# Altium schematic sheet RP2_pico.SchDoc
size A3; SheetNumber: 1; SheetTotal: 4
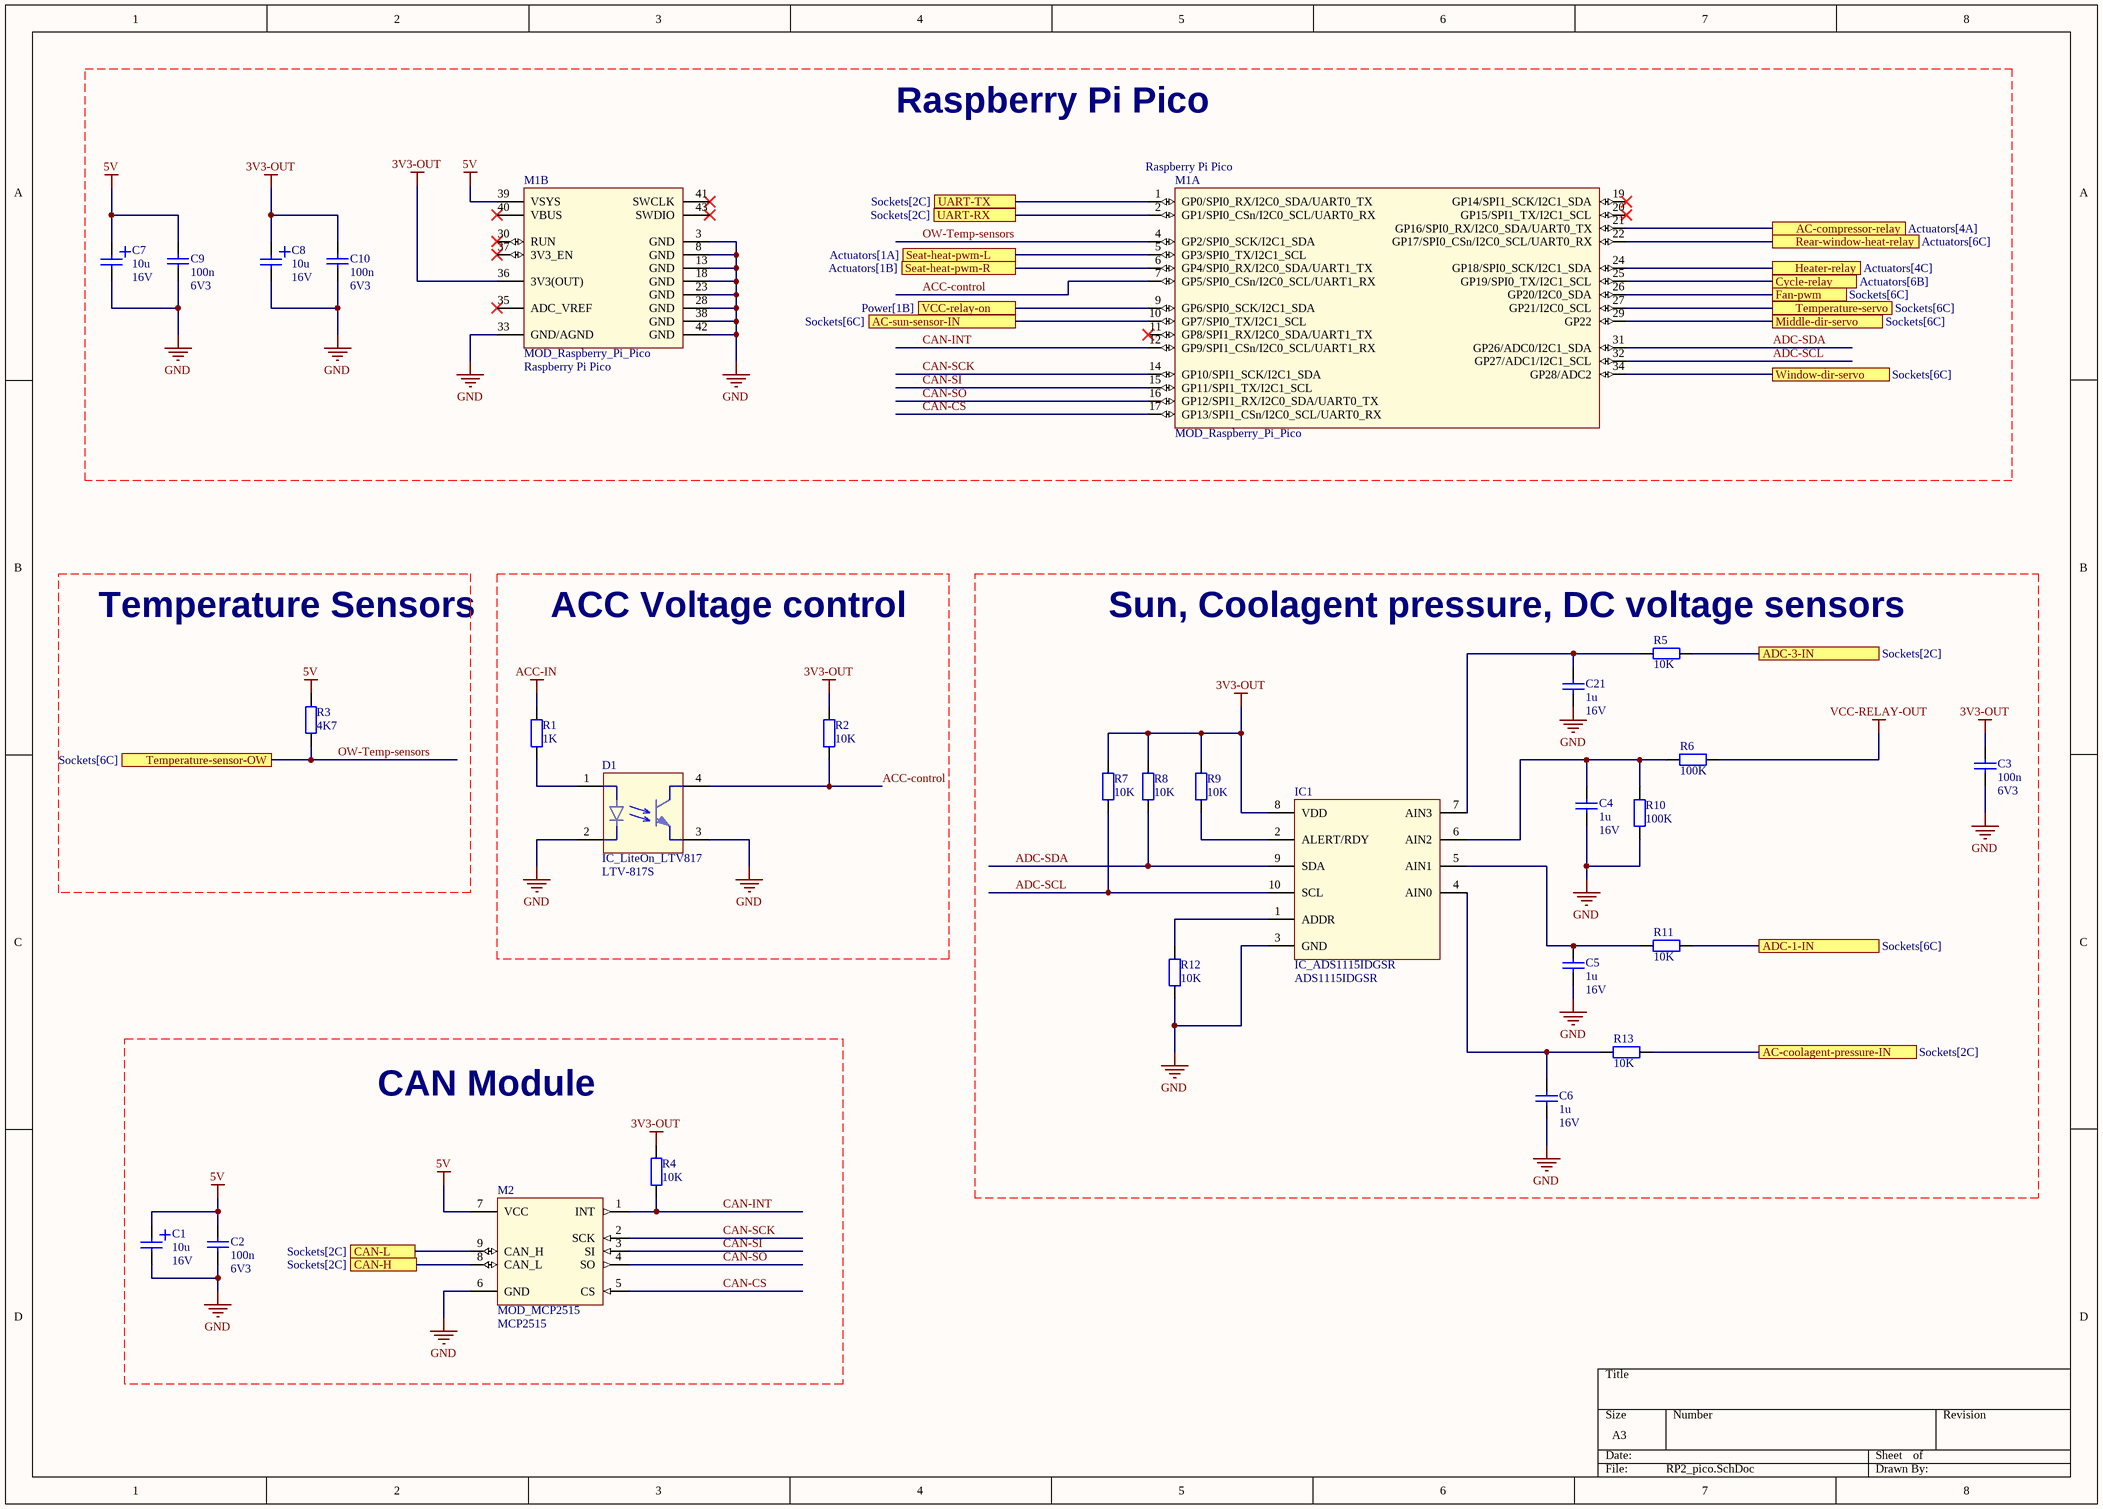
[diagram p0: RP2_pico.SchDoc]

## Parts
C1  Value1: 10u  Value2: 16V  [CAPAE430X550N]  (hidden comment: CAP_POL)
C2  Value1: 100n  Value2: 6V3  [CAPC2012X88N]  (hidden comment: CAP)
C3  Value1: 100n  Value2: 6V3  [CAPC2012X88N]  (hidden comment: CAP)
C4  Value1: 1u  Value2: 16V  [CAPC2012X88N]  (hidden comment: CAP)
C5  Value1: 1u  Value2: 16V  [CAPC2012X88N]  (hidden comment: CAP)
C6  Value1: 1u  Value2: 16V  [CAPC2012X88N]  (hidden comment: CAP)
C7  Value1: 10u  Value2: 16V  [CAPAE430X550N]  (hidden comment: CAP_POL)
C8  Value1: 10u  Value2: 16V  [CAPAE430X550N]  (hidden comment: CAP_POL)
C9  Value1: 100n  Value2: 6V3  [CAPC2012X88N]  (hidden comment: CAP)
C10  Value1: 100n  Value2: 6V3  [CAPC2012X88N]  (hidden comment: CAP)
C21  Value1: 1u  Value2: 16V  [CAPC2012X88N]  (hidden comment: CAP)
D1  IC_LiteOn_LTV817  Value1: LTV-817S  [IC_LiteOn_ LTV-817S]
IC1  IC_ADS1115IDGSR  Value1: ADS1115IDGSR  [VSSOP-10]
M1  MOD_Raspberry_Pi_Pico  Value1: Raspberry Pi Pico  [MOD_Raspberry_Pi_Pico]  (parts A,B of 2)
M2  MOD_MCP2515  Value1: MCP2515  [MOD_MCP2515]
R1  Value1: 1K  [RESC2012X60N]  (hidden comment: RES)
R2  Value1: 10K  [RESC2012X60N]  (hidden comment: RES)
R3  Value1: 4K7  [RESC2012X60N]  (hidden comment: RES)
R4  Value1: 10K  [RESC2012X60N]  (hidden comment: RES)
R5  Value1: 10K  [RESC2012X60N]  (hidden comment: RES)
R6  Value1: 100K  [RESC2012X60N]  (hidden comment: RES)
R7  Value1: 10K  [RESC2012X60N]  (hidden comment: RES)
R8  Value1: 10K  [RESC2012X60N]  (hidden comment: RES)
R9  Value1: 10K  [RESC2012X60N]  (hidden comment: RES)
R10  Value1: 100K  [RESC2012X60N]  (hidden comment: RES)
R11  Value1: 10K  [RESC2012X60N]  (hidden comment: RES)
R12  Value1: 10K  [RESC2012X60N]  (hidden comment: RES)
R13  Value1: 10K  [RESC2012X60N]  (hidden comment: RES)

## Ports
AC-compressor-relay (see Actuators[4A]), AC-coolagent-pressure-IN (see Sockets[2C]), AC-sun-sensor-IN (see Sockets[6C]), ADC-1-IN (see Sockets[6C]), ADC-3-IN (see Sockets[2C]), CAN-H (see Sockets[2C]), CAN-L (see Sockets[2C]), Cycle-relay (see Actuators[6B]), Fan-pwm (see Sockets[6C]), Heater-relay (see Actuators[4C]), Middle-dir-servo (see Sockets[6C]), Rear-window-heat-relay (see Actuators[6C]), Seat-heat-pwm-L (see Actuators[1A]), Seat-heat-pwm-R (see Actuators[1B]), Temperature-sensor-OW (see Sockets[6C]), Temperature-servo (see Sockets[6C]), UART-RX (see Sockets[2C]), UART-TX (see Sockets[2C]), VCC-relay-on (see Power[1B]), Window-dir-servo (see Sockets[6C])

## Nets
3V3-OUT: C3.2 C8.1 C10.2 IC1.8(VDD) M1.36(3V3(OUT)) R2.2 R4.2 R7.2 R8.2 R9.2
5V: C1.1 C2.2 C7.1 C9.2 M1.39(VSYS) M2.7(VCC) R3.2
ACC-IN: R1.2
GND: C1.2 C2.1 C3.1 C4.1 C5.1 C6.1 C7.2 C8.2 C9.1 C10.1 C21.1 D1.2 D1.3 IC1.3(GND) M1.3(GND) M1.8(GND) M1.13(GND) M1.18(GND) M1.23(GND) M1.28(GND) M1.33(GND/AGND) M1.38(GND) M1.42(GND) M2.6(GND) R10.1 R12.1
VCC-RELAY-OUT: R6.2
AC-compressor-relay: M1.21(GP16/SPI0_RX/I2C0_SDA/UART0_TX) ; port AC-compressor-relay
AC-coolagent-pressure-IN: R13.2 ; port AC-coolagent-pressure-IN
AC-sun-sensor-IN: M1.10(GP7/SPI0_TX/I2C1_SCL) ; port AC-sun-sensor-IN
ACC-control: D1.4 M1.7(GP5/SPI0_CSn/I2C0_SCL/UART1_RX) R2.1
ADC-1-IN: R11.2 ; port ADC-1-IN
ADC-3-IN: R5.2 ; port ADC-3-IN
ADC-SCL: IC1.10(SCL) M1.32(GP27/ADC1/I2C1_SCL) R7.1
ADC-SDA: IC1.9(SDA) M1.31(GP26/ADC0/I2C1_SDA) R8.1
CAN-CS: M1.17(GP13/SPI1_CSn/I2C0_SCL/UART0_RX) M2.5(CS)
CAN-H: M2.8(CAN_L) ; port CAN-H
CAN-INT: M1.12(GP9/SPI1_CSn/I2C0_SCL/UART1_RX) M2.1(INT) R4.1
CAN-L: M2.9(CAN_H) ; port CAN-L
CAN-SCK: M1.14(GP10/SPI1_SCK/I2C1_SDA) M2.2(SCK)
CAN-SI: M1.15(GP11/SPI1_TX/I2C1_SCL) M2.3(SI)
CAN-SO: M1.16(GP12/SPI1_RX/I2C0_SDA/UART0_TX) M2.4(SO)
Cycle-relay: M1.25(GP19/SPI0_TX/I2C1_SCL) ; port Cycle-relay
Fan-pwm: M1.26(GP20/I2C0_SDA) ; port Fan-pwm
Heater-relay: M1.24(GP18/SPI0_SCK/I2C1_SDA) ; port Heater-relay
Middle-dir-servo: M1.29(GP22) ; port Middle-dir-servo
OW-Temp-sensors: M1.4(GP2/SPI0_SCK/I2C1_SDA) R3.1 ; port Temperature-sensor-OW
Rear-window-heat-relay: M1.22(GP17/SPI0_CSn/I2C0_SCL/UART0_RX) ; port Rear-window-heat-relay
Seat-heat-pwm-L: M1.5(GP3/SPI0_TX/I2C1_SCL) ; port Seat-heat-pwm-L
Seat-heat-pwm-R: M1.6(GP4/SPI0_RX/I2C0_SDA/UART1_TX) ; port Seat-heat-pwm-R
Temperature-servo: M1.27(GP21/I2C0_SCL) ; port Temperature-servo
UART-RX: M1.2(GP1/SPI0_CSn/I2C0_SCL/UART0_RX) ; port UART-RX
UART-TX: M1.1(GP0/SPI0_RX/I2C0_SDA/UART0_TX) ; port UART-TX
VCC-relay-on: M1.9(GP6/SPI0_SCK/I2C1_SDA) ; port VCC-relay-on
Window-dir-servo: M1.34(GP28/ADC2) ; port Window-dir-servo
NetC4_2: C4.2 IC1.6(AIN2) R6.1 R10.2
NetC5_2: C5.2 IC1.5(AIN1) R11.1
NetC6_2: C6.2 IC1.4(AIN0) R13.1
NetC21_2: C21.2 IC1.7(AIN3) R5.1
NetD1_1: D1.1 R1.1
NetIC1_1: IC1.1(ADDR) R12.2
NetIC1_2: IC1.2(ALERT/RDY) R9.1

Not connected (* = marked no-connect by the designer): M1 11(GP8/SPI1_RX/I2C0_SDA/UART1_TX)* 19(GP14/SPI1_SCK/I2C1_SDA)* 20(GP15/SPI1_TX/I2C1_SCL)* 30(RUN)* 35(ADC_VREF)* 37(3V3_EN)* 40(VBUS)* 41(SWCLK)* 43(SWDIO)*

## Notes on the sheet
- Raspberry Pi Pico
- Temperature Sensors
- ACC Voltage control
- (near R5) Sun, Coolagent pressure, DC voltage sensors
- CAN Module

## Library data of the parts
C1 C7 C8 = 01_01399: ELCO 20%; Manufacturer: Nichicon; Manufacturer PN: UWF1C100MCL1GB; AutoId: 1399; DeviceType: capacitor; SubType: Electrolyte; Id: 01_01399; Status: 2 - Checked and Approved; MountType: SMT; ComponentLink1URL: X:\01_Datasheets\CAP_NICHICON_UWF1C100MCL1GB.pdf; Supplier 1: Farnell; Supplier Part Number 1: 647-UWF1C100MCL1GB; ComponentLink1Description: Datasheet
C2 C3 C9 C10 = 01_00637: X7R 10% 0805; Manufacturer: KEMET; Manufacturer PN: C0805C104K9RACTU; AutoId: 637; DeviceType: capacitor; SubType: Ceramic; Id: 01_00637; Status: 2 - Checked and Approved; MountType: SMT; ComponentLink1URL: X:\01_Datasheets\CAP_KEMET_CxxxxCxxxXxRAC.pdf; Supplier 1: Farnell; Supplier Part Number 1: 80-C0805C104K9R; ComponentLink1Description: Datasheet
C4-C6 C21 = 01_11496: Manufacturer: Hitano; Manufacturer PN: 0805B105K160N3; AutoId: 1562; Value3: X7R; DeviceType: capacitor; SubType: Ceramic; Id: 01_11496; Status: 0 - Unchecked; MountType: SMT; ComponentLink1URL: X:\01_Datasheets\; Supplier 1: Farnell; ComponentLink1Description: Datasheet
D1 = 07_00275: Transistor Output Optocouplers Optocoupler Phototrans; Manufacturer: Lite-On; AutoId: 276; Id: 07_00275; Value2: Optocouplers; Value3: Optocouplers; Manufacturer PN: LTV-817S; DeviceType: Optocouple; Status: 0 - Unchecked; MountType: SMT; ComponentLink1Description: Datasheet; ComponentLink1URL: X:\01_Datasheets\IC_Lite_On_LTV-817S.pdf; ComponentLink2Description: ComponentVerificationSheet; ComponentLink2URL: X:\02_ComponentVerificationSheets\; Supplier 1: Mouser; Supplier Part Number 1: 859-LTV-817S
IC1 = 07_00293: Analog to Digital Converters - ADC 16B ADC w/ Int MUX PGA Comp Osc & Ref; Manufacturer: Texas Instruments; AutoId: 300; Value2: 10 pin I2C ADC; DeviceType: IC; Id: 07_00293; Manufacturer PN: ADS1115IDGSR; Status: 0 - Unchecked; MountType: SMT; ComponentLink1Description: Datasheet; ComponentLink1URL: X:\01_Datasheets\ads1115.pdf; ComponentLink2Description: ComponentVerificationSheet; ComponentLink2URL: X:\02_ComponentVerificationSheets\
M1 = 12_00158: Single Board Computers Raspberry Pi Pico; Manufacturer PN: SC0915; AutoId: 169; Value2: RP2040; Value3: ARM Cortex M0; DeviceType: misc; Id: 12_00158; Manufacturer: Raspberry Pi; MountType: SMT; ComponentLink1Description: Datasheet; ComponentLink1URL: X:\01_Datasheets\Raspberry_Pi_Pico.pdf; ComponentLink2Description: ComponentVerificationSheet; ComponentLink2URL: X:\02_ComponentVerificationSheets\; Supplier 1: Mouser; Supplier Part Number 1: 358-SC0915
M2 = 12_00161: CAN bus  module; Manufacturer: CH; AutoId: 172; DeviceType: misc; Id: 12_00161; Value2: Module; Status: 0 - Unchecked; MountType: THD; ComponentLink1Description: Datasheet; ComponentLink1URL: X:\01_Datasheets\; ComponentLink2Description: ComponentVerificationSheet; ComponentLink2URL: X:\02_ComponentVerificationSheets\; Supplier 1: Arduino.ua
R1 = 15_00329: RESISTOR, 0805, 1K, 1%, SMD; Manufacturer: Yageo; Manufacturer PN: RC0805FR-071K; Id: 15_00341; AutoId: 329; Value2: 0W125; SubType: Metal film; DeviceType: resistor; Status: 2 - Checked and Approved; MountType: SMT; ComponentLink1Description: Datasheet; ComponentLink1URL: X:\01_Datasheets\RES_YAGEO_RC0805FR.pdf; Supplier 1: Farnell; Supplier Part Number 1: 9237496
R2 R4 R7-R9 R11-R13 = 15_00341: RESISTOR, 0805, 10K, 1%, SMD; Manufacturer: Yageo; Manufacturer PN: RC0805FR-0710K; AutoId: 341; Value2: 0W125; SubType: Metal film; Id: 15_00341; DeviceType: resistor; Status: 0 - Unchecked; MountType: SMT; ComponentLink1Description: Datasheet; ComponentLink1URL: X:\01_Datasheets\RES_YAGEO_RC0805FR.pdf; Supplier 1: Farnell
R3 = 15_00337: RESISTOR, 0805, 4K7, 1%, SMD; Manufacturer: Yageo; Manufacturer PN: RC0805FR-074K7; AutoId: 337; Value2: 0W125; SubType: Metal film; Id: 15_00337; DeviceType: resistor; Status: 2 - Checked and Approved; MountType: SMT; ComponentLink1Description: Datasheet; ComponentLink1URL: X:\01_Datasheets\RES_YAGEO_RC0805FR.pdf; Supplier 1: Farnell; Supplier Part Number 1: 9237704
R5 R6 R10 = 15_00353: RESISTOR, 0805, 100K, 1%, SMD; Manufacturer: Yageo; Manufacturer PN: RC0805FR-07100K; AutoId: 353; Value2: 0W125; SubType: Metal film; Id: 15_00353; DeviceType: resistor; Status: 0 - Unchecked; MountType: SMT; ComponentLink1Description: Datasheet; ComponentLink1URL: X:\01_Datasheets\RES_YAGEO_RC0805FR.pdf; Supplier 1: Farnell